# EAGLE schematic enigma (EAGLE 7.7.0)
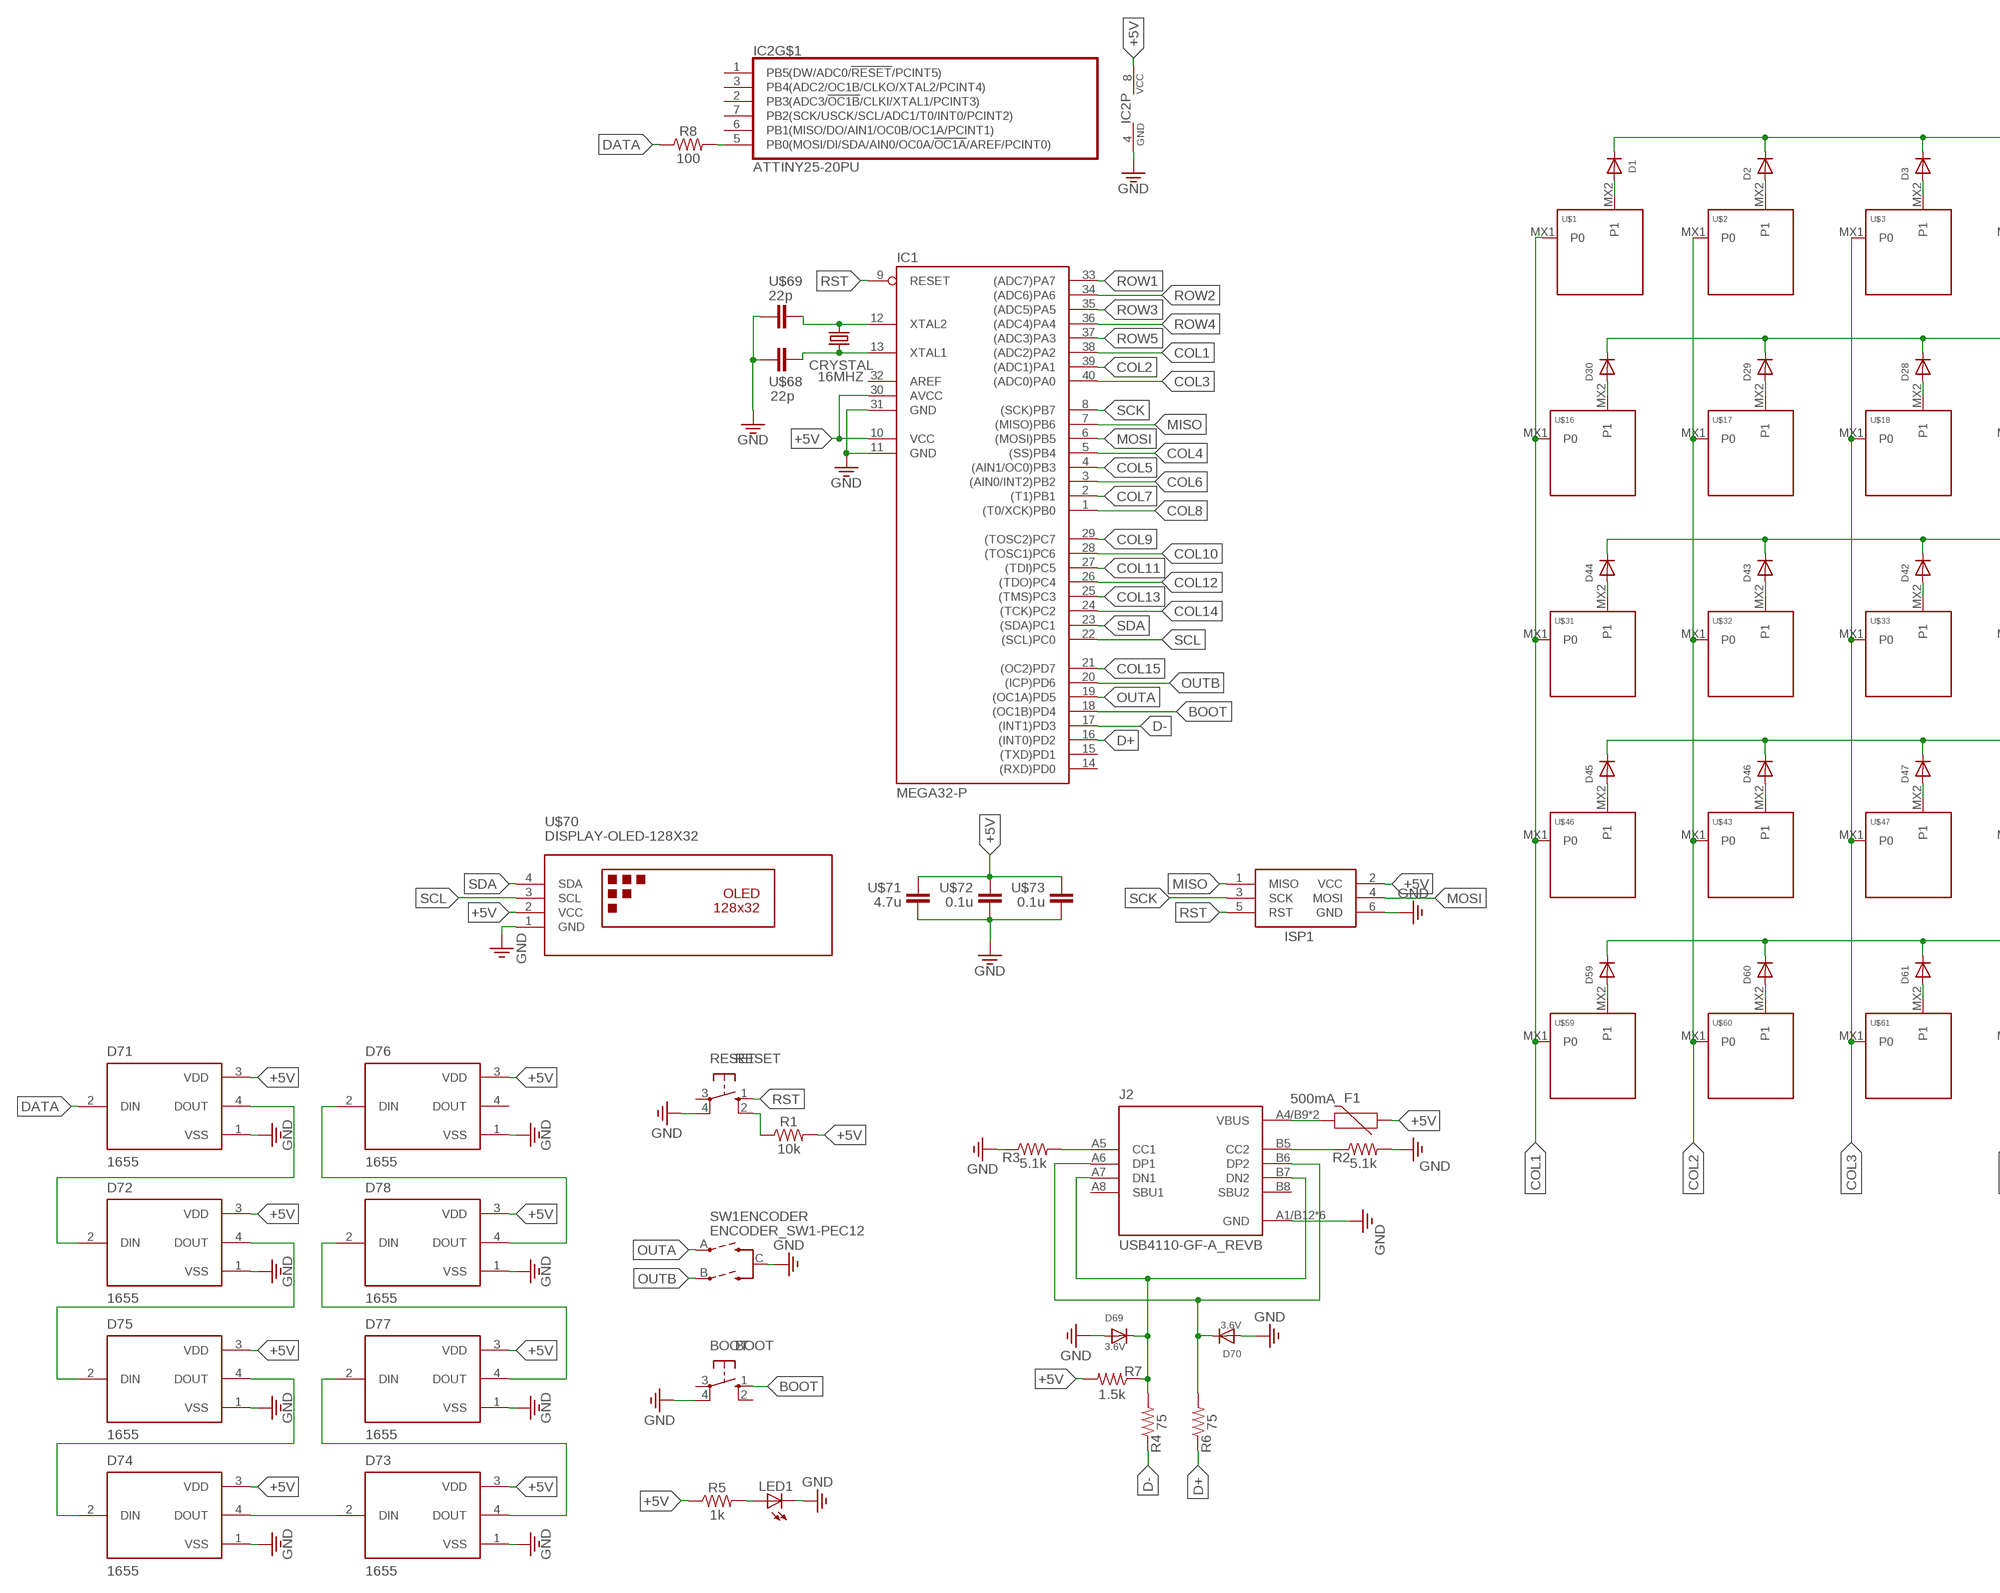
[diagram p0: schematic, sheet 1, part 1 of 2]
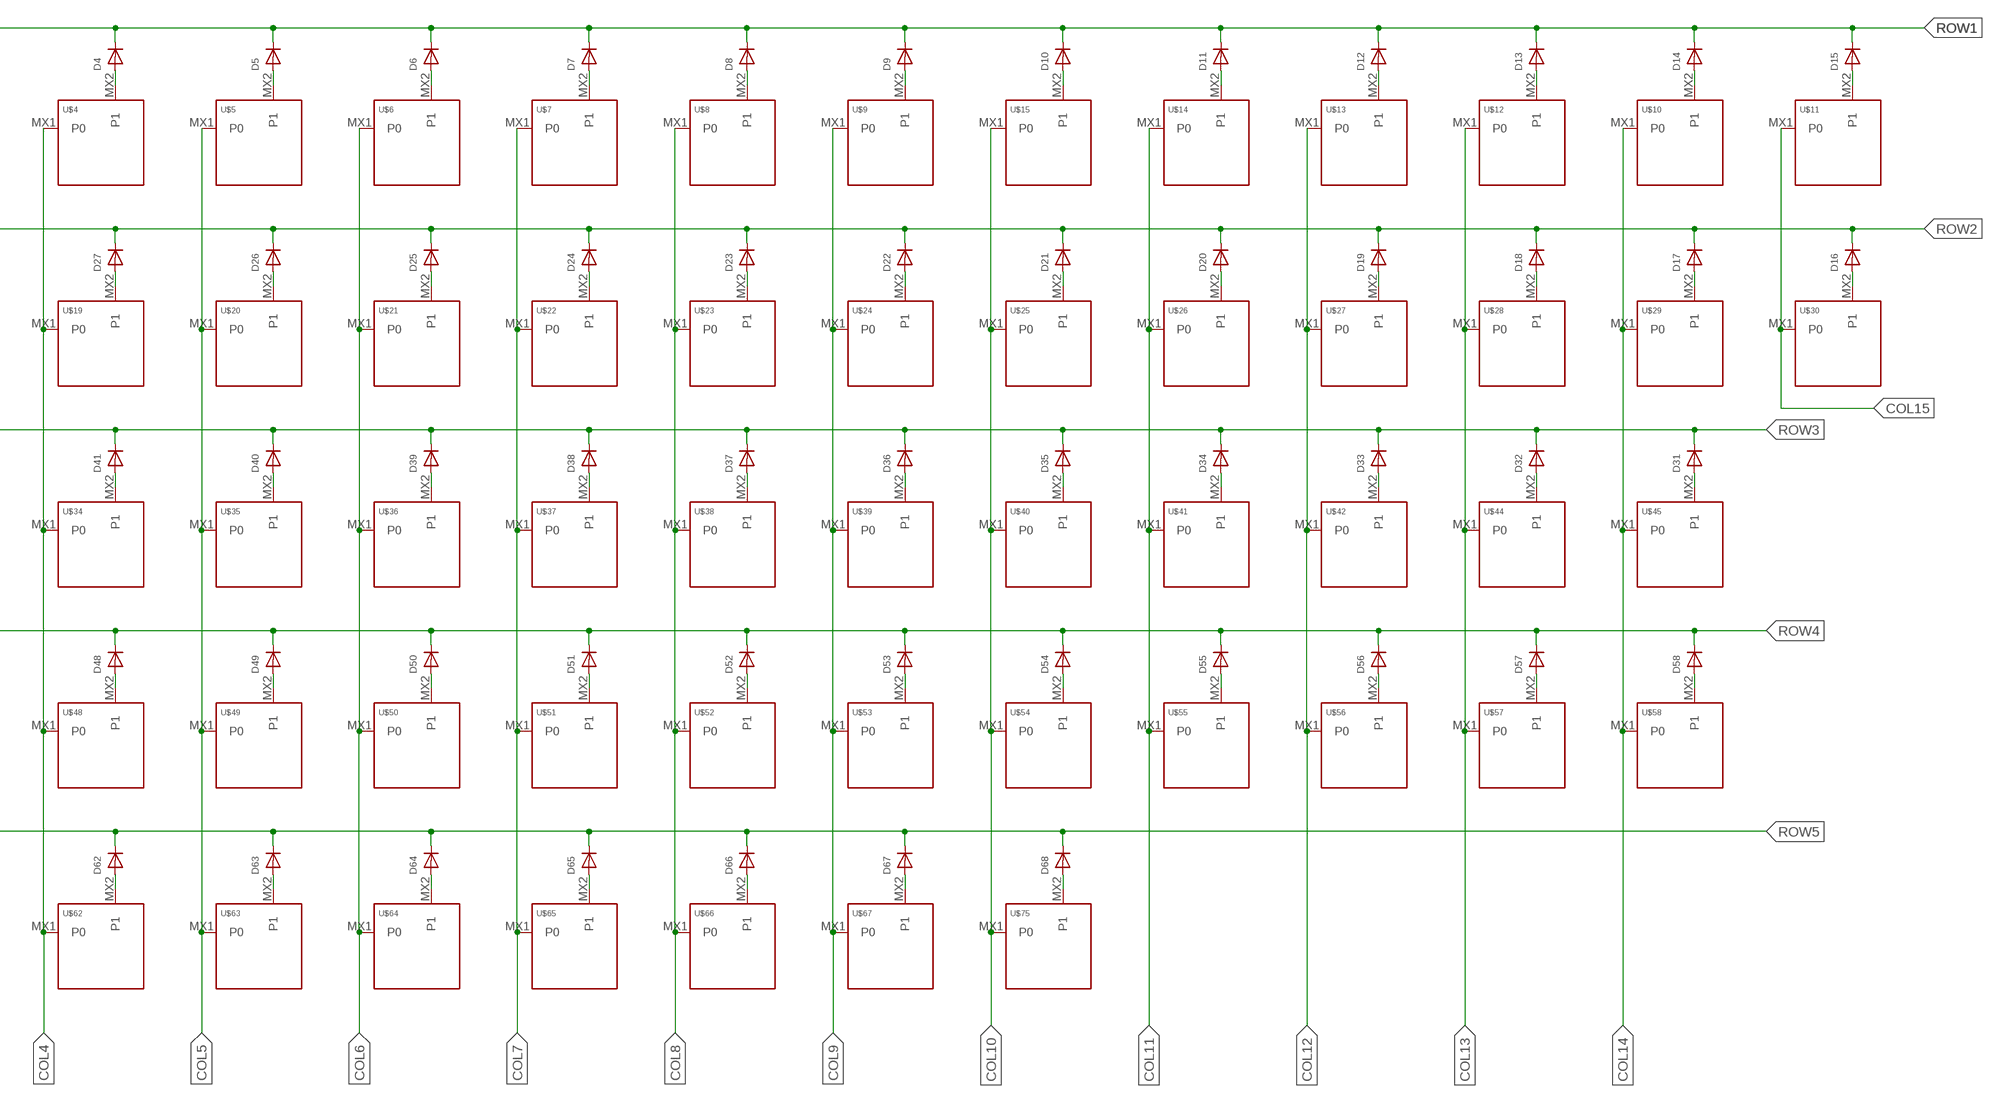
[diagram p1: schematic, sheet 1, part 2 of 2]

## Parts
BOOT  BOOT  10-XX  [B3F-10XX]
CRYSTAL  16MHZ  CRYSTALHC49U-V  [HC49U-V]
D1  DIODEDO-1N4148  [DO-1N4148]
D2  DIODEDO-1N4148  [DO-1N4148]
D3  DIODEDO-1N4148  [DO-1N4148]
D4  DIODEDO-1N4148  [DO-1N4148]
D5  DIODEDO-1N4148  [DO-1N4148]
D6  DIODEDO-1N4148  [DO-1N4148]
D7  DIODEDO-1N4148  [DO-1N4148]
D8  DIODEDO-1N4148  [DO-1N4148]
D9  DIODEDO-1N4148  [DO-1N4148]
D10  DIODEDO-1N4148  [DO-1N4148]
D11  DIODEDO-1N4148  [DO-1N4148]
D12  DIODEDO-1N4148  [DO-1N4148]
D13  DIODEDO-1N4148  [DO-1N4148]
D14  DIODEDO-1N4148  [DO-1N4148]
D15  DIODEDO-1N4148  [DO-1N4148]
D16  DIODEDO-1N4148  [DO-1N4148]
D17  DIODEDO-1N4148  [DO-1N4148]
D18  DIODEDO-1N4148  [DO-1N4148]
D19  DIODEDO-1N4148  [DO-1N4148]
D20  DIODEDO-1N4148  [DO-1N4148]
D21  DIODEDO-1N4148  [DO-1N4148]
D22  DIODEDO-1N4148  [DO-1N4148]
D23  DIODEDO-1N4148  [DO-1N4148]
D24  DIODEDO-1N4148  [DO-1N4148]
D25  DIODEDO-1N4148  [DO-1N4148]
D26  DIODEDO-1N4148  [DO-1N4148]
D27  DIODEDO-1N4148  [DO-1N4148]
D28  DIODEDO-1N4148  [DO-1N4148]
D29  DIODEDO-1N4148  [DO-1N4148]
D30  DIODEDO-1N4148  [DO-1N4148]
D31  DIODEDO-1N4148  [DO-1N4148]
D32  DIODEDO-1N4148  [DO-1N4148]
D33  DIODEDO-1N4148  [DO-1N4148]
D34  DIODEDO-1N4148  [DO-1N4148]
D35  DIODEDO-1N4148  [DO-1N4148]
D36  DIODEDO-1N4148  [DO-1N4148]
D37  DIODEDO-1N4148  [DO-1N4148]
D38  DIODEDO-1N4148  [DO-1N4148]
D39  DIODEDO-1N4148  [DO-1N4148]
D40  DIODEDO-1N4148  [DO-1N4148]
D41  DIODEDO-1N4148  [DO-1N4148]
D42  DIODEDO-1N4148  [DO-1N4148]
D43  DIODEDO-1N4148  [DO-1N4148]
D44  DIODEDO-1N4148  [DO-1N4148]
D45  DIODEDO-1N4148  [DO-1N4148]
D46  DIODEDO-1N4148  [DO-1N4148]
D47  DIODEDO-1N4148  [DO-1N4148]
D48  DIODEDO-1N4148  [DO-1N4148]
D49  DIODEDO-1N4148  [DO-1N4148]
D50  DIODEDO-1N4148  [DO-1N4148]
D51  DIODEDO-1N4148  [DO-1N4148]
D52  DIODEDO-1N4148  [DO-1N4148]
D53  DIODEDO-1N4148  [DO-1N4148]
D54  DIODEDO-1N4148  [DO-1N4148]
D55  DIODEDO-1N4148  [DO-1N4148]
D56  DIODEDO-1N4148  [DO-1N4148]
D57  DIODEDO-1N4148  [DO-1N4148]
D58  DIODEDO-1N4148  [DO-1N4148]
D59  DIODEDO-1N4148  [DO-1N4148]
D60  DIODEDO-1N4148  [DO-1N4148]
D61  DIODEDO-1N4148  [DO-1N4148]
D62  DIODEDO-1N4148  [DO-1N4148]
D63  DIODEDO-1N4148  [DO-1N4148]
D64  DIODEDO-1N4148  [DO-1N4148]
D65  DIODEDO-1N4148  [DO-1N4148]
D66  DIODEDO-1N4148  [DO-1N4148]
D67  DIODEDO-1N4148  [DO-1N4148]
D68  DIODEDO-1N4148  [DO-1N4148]
D69  3.6V  DIODEDO-1N4148  [DO-1N4148]
D70  3.6V  DIODEDO-1N4148  [DO-1N4148]
D71  1655  [LED_1655]
D72  1655  [LED_1655]
D73  1655  [LED_1655]
D74  1655  [LED_1655]
D75  1655  [LED_1655]
D76  1655  [LED_1655]
D77  1655  [LED_1655]
D78  1655  [LED_1655]
F1  500mA  PPTC_PTH  [PTH]
IC1  MEGA32-P  [DIL40]
IC2  ATTINY25-20PU  [DIL08]
ISP1  AVRISP-6  [AVRISP]
J2  USB4110-GF-A_REVB  [GCT_USB4110-GF-A_REVB]
LED1  LED5MM  [LED5MM]
R1  10k  RESISTORAXIAL-0.3  [AXIAL-0.3]
R2  5.1k  RESISTORAXIAL-0.3  [AXIAL-0.3]
R3  5.1k  RESISTORAXIAL-0.3  [AXIAL-0.3]
R4  75  RESISTORAXIAL-0.3  [AXIAL-0.3]
R5  1k  RESISTORAXIAL-0.3  [AXIAL-0.3]
R6  75  RESISTORAXIAL-0.3  [AXIAL-0.3]
R7  1.5k  RESISTORAXIAL-0.3  [AXIAL-0.3]
R8  100  RESISTORAXIAL-0.3  [AXIAL-0.3]
RESET  RESET  10-XX  [B3F-10XX]
SW1  ENCODER_SW1-PEC12  [PEC12_INCREMENTAL_ENCODER]
U$1  KEYSWITCH-PLAIN-MXHSPCB-1U  [MXHSPCB-1U]
U$2  KEYSWITCH-PLAIN-MXHSPCB-1U  [MXHSPCB-1U]
U$3  KEYSWITCH-PLAIN-MXHSPCB-1U  [MXHSPCB-1U]
U$4  KEYSWITCH-PLAIN-MXHSPCB-1U  [MXHSPCB-1U]
U$5  KEYSWITCH-PLAIN-MXHSPCB-1U  [MXHSPCB-1U]
U$6  KEYSWITCH-PLAIN-MXHSPCB-1U  [MXHSPCB-1U]
U$7  KEYSWITCH-PLAIN-MXHSPCB-1U  [MXHSPCB-1U]
U$8  KEYSWITCH-PLAIN-MXHSPCB-1U  [MXHSPCB-1U]
U$9  KEYSWITCH-PLAIN-MXHSPCB-1U  [MXHSPCB-1U]
U$10  KEYSWITCH-PLAIN-MXHSPCB-2U  [MXHSPCB-2U]
U$11  KEYSWITCH-PLAIN-MXHSPCB-1U  [MXHSPCB-1U]
U$12  KEYSWITCH-PLAIN-MXHSPCB-1U  [MXHSPCB-1U]
U$13  KEYSWITCH-PLAIN-MXHSPCB-1U  [MXHSPCB-1U]
U$14  KEYSWITCH-PLAIN-MXHSPCB-1U  [MXHSPCB-1U]
U$15  KEYSWITCH-PLAIN-MXHSPCB-1U  [MXHSPCB-1U]
U$16  KEYSWITCH-PLAIN-MXHSPCB-1U  [MXHSPCB-1U]
U$17  KEYSWITCH-PLAIN-MXHSPCB-1U  [MXHSPCB-1U]
U$18  KEYSWITCH-PLAIN-MXHSPCB-1U  [MXHSPCB-1U]
U$19  KEYSWITCH-PLAIN-MXHSPCB-1U  [MXHSPCB-1U]
U$20  KEYSWITCH-PLAIN-MXHSPCB-1U  [MXHSPCB-1U]
U$21  KEYSWITCH-PLAIN-MXHSPCB-1U  [MXHSPCB-1U]
U$22  KEYSWITCH-PLAIN-MXHSPCB-1U  [MXHSPCB-1U]
U$23  KEYSWITCH-PLAIN-MXHSPCB-1U  [MXHSPCB-1U]
U$24  KEYSWITCH-PLAIN-MXHSPCB-1U  [MXHSPCB-1U]
U$25  KEYSWITCH-PLAIN-MXHSPCB-1U  [MXHSPCB-1U]
U$26  KEYSWITCH-PLAIN-MXHSPCB-1U  [MXHSPCB-1U]
U$27  KEYSWITCH-PLAIN-MXHSPCB-1U  [MXHSPCB-1U]
U$28  KEYSWITCH-PLAIN-MXHSPCB-1U  [MXHSPCB-1U]
U$29  KEYSWITCH-PLAIN-MXHSPCB-1U  [MXHSPCB-1U]
U$30  KEYSWITCH-PLAIN-MXHSPCB-1U  [MXHSPCB-1U]
U$31  KEYSWITCH-PLAIN-MXHSPCB-1U  [MXHSPCB-1U]
U$32  KEYSWITCH-PLAIN-MXHSPCB-1U  [MXHSPCB-1U]
U$33  KEYSWITCH-PLAIN-MXHSPCB-1U  [MXHSPCB-1U]
U$34  KEYSWITCH-PLAIN-MXHSPCB-1U  [MXHSPCB-1U]
U$35  KEYSWITCH-PLAIN-MXHSPCB-1U  [MXHSPCB-1U]
U$36  KEYSWITCH-PLAIN-MXHSPCB-1U  [MXHSPCB-1U]
U$37  KEYSWITCH-PLAIN-MXHSPCB-1U  [MXHSPCB-1U]
U$38  KEYSWITCH-PLAIN-MXHSPCB-1U  [MXHSPCB-1U]
U$39  KEYSWITCH-PLAIN-MXHSPCB-1U  [MXHSPCB-1U]
U$40  KEYSWITCH-PLAIN-MXHSPCB-1U  [MXHSPCB-1U]
U$41  KEYSWITCH-PLAIN-MXHSPCB-1U  [MXHSPCB-1U]
U$42  KEYSWITCH-PLAIN-MXHSPCB-1U  [MXHSPCB-1U]
U$43  KEYSWITCH-PLAIN-MXHSPCB-1U  [MXHSPCB-1U]
U$44  KEYSWITCH-PLAIN-MXHSPCB-2U-FLIPPED  [MXHSPCB-2U-FLIPPED]
U$45  KEYSWITCH-PLAIN-MXHSPCB-1U  [MXHSPCB-1U]
U$46  KEYSWITCH-PLAIN-MXHSPCB-2U-FLIPPED  [MXHSPCB-2U-FLIPPED]
U$47  KEYSWITCH-PLAIN-MXHSPCB-1U  [MXHSPCB-1U]
U$48  KEYSWITCH-PLAIN-MXHSPCB-1U  [MXHSPCB-1U]
U$49  KEYSWITCH-PLAIN-MXHSPCB-1U  [MXHSPCB-1U]
U$50  KEYSWITCH-PLAIN-MXHSPCB-1U  [MXHSPCB-1U]
U$51  KEYSWITCH-PLAIN-MXHSPCB-1U  [MXHSPCB-1U]
U$52  KEYSWITCH-PLAIN-MXHSPCB-1U  [MXHSPCB-1U]
U$53  KEYSWITCH-PLAIN-MXHSPCB-1U  [MXHSPCB-1U]
U$54  KEYSWITCH-PLAIN-MXHSPCB-1U  [MXHSPCB-1U]
U$55  KEYSWITCH-PLAIN-MXHSPCB-1U  [MXHSPCB-1U]
U$56  KEYSWITCH-PLAIN-MXHSPCB-1U  [MXHSPCB-1U]
U$57  KEYSWITCH-PLAIN-MXHSPCB-1U  [MXHSPCB-1U]
U$58  KEYSWITCH-PLAIN-MXHSPCB-1U  [MXHSPCB-1U]
U$59  KEYSWITCH-PLAIN-MXHSPCB-1U  [MXHSPCB-1U]
U$60  KEYSWITCH-PLAIN-MXHSPCB-1U  [MXHSPCB-1U]
U$61  KEYSWITCH-PLAIN-MXHSPCB-1U  [MXHSPCB-1U]
U$62  KEYSWITCH-PLAIN-MXHSPCB-6.25U-FLIPPED  [MXHSPCB-6.25U-FLIPPED]
U$63  KEYSWITCH-PLAIN-MXHSPCB-1U  [MXHSPCB-1U]
U$64  KEYSWITCH-PLAIN-MXHSPCB-1U  [MXHSPCB-1U]
U$65  KEYSWITCH-PLAIN-MXHSPCB-1U  [MXHSPCB-1U]
U$66  KEYSWITCH-PLAIN-MXHSPCB-1U  [MXHSPCB-1U]
U$67  KEYSWITCH-PLAIN-MXHSPCB-1U  [MXHSPCB-1U]
U$68  22p  CAP  [CAP-TH]
U$69  22p  CAP  [CAP-TH]
U$70  DISPLAY-OLED-128X32  [DISPLAY-OLED-128X32]
U$71  4.7u  CAP  [CAP-TH]
U$72  0.1u  CAP  [CAP-TH]
U$73  0.1u  CAP  [CAP-TH]
U$75  KEYSWITCH-PLAIN-MXHSPCB-1U  [MXHSPCB-1U]

## Nets
3.3V: BOOT.4(P1) D69.A D70.A D71.1(VSS) D72.1(VSS) D73.1(VSS) D74.1(VSS) D75.1(VSS) D76.1(VSS) D77.1(VSS) D78.1(VSS) IC1.11(GND) IC1.31(GND) IC2.4(P:GND) ISP1.6(GND) J2.A1/B12(GND) J2.B1/A12(GND) J2.S1(GND) J2.S2(GND) J2.S3(GND) J2.S4(GND) LED1.K(C) R2.P$2 R3.P$1 RESET.4(P1) SW1.C(ENCODER:C) U$68.2 U$69.1 U$70.1(GND) U$71.1 U$72.1 U$73.1 ; supply symbol labelled GND
+5V: D71.3(VDD) D72.3(VDD) D73.3(VDD) D74.3(VDD) D75.3(VDD) D76.3(VDD) D77.3(VDD) D78.3(VDD) F1.P$1 IC1.10(VCC) IC1.30(AVCC) IC2.8(P:VCC) ISP1.2(VCC) R1.P$2 R5.P$1 R7.P$2 U$70.2(VCC) U$71.2 U$72.2 U$73.2
BOOT: BOOT.1(S) IC1.18((OC1B)PD4)
COL1: IC1.38((ADC2)PA2) U$1.MX1(P0) U$16.MX1(P0) U$31.MX1(P0) U$46.MX1(P0) U$59.MX1(P0)
COL2: IC1.39((ADC1)PA1) U$2.MX1(P0) U$17.MX1(P0) U$32.MX1(P0) U$43.MX1(P0) U$60.MX1(P0)
COL3: IC1.40((ADC0)PA0) U$3.MX1(P0) U$18.MX1(P0) U$33.MX1(P0) U$47.MX1(P0) U$61.MX1(P0)
COL4: IC1.5((SS)PB4) U$4.MX1(P0) U$19.MX1(P0) U$34.MX1(P0) U$48.MX1(P0) U$62.MX1(P0)
COL5: IC1.4((AIN1/OC0)PB3) U$5.MX1(P0) U$20.MX1(P0) U$35.MX1(P0) U$49.MX1(P0) U$63.MX1(P0)
COL6: IC1.3((AIN0/INT2)PB2) U$6.MX1(P0) U$21.MX1(P0) U$36.MX1(P0) U$50.MX1(P0) U$64.MX1(P0)
COL7: IC1.2((T1)PB1) U$7.MX1(P0) U$22.MX1(P0) U$37.MX1(P0) U$51.MX1(P0) U$65.MX1(P0)
COL8: IC1.1((T0/XCK)PB0) U$8.MX1(P0) U$23.MX1(P0) U$38.MX1(P0) U$52.MX1(P0) U$66.MX1(P0)
COL9: IC1.29((TOSC2)PC7) U$9.MX1(P0) U$24.MX1(P0) U$39.MX1(P0) U$53.MX1(P0) U$67.MX1(P0)
COL10: IC1.28((TOSC1)PC6) U$15.MX1(P0) U$25.MX1(P0) U$40.MX1(P0) U$54.MX1(P0) U$75.MX1(P0)
COL11: IC1.27((TDI)PC5) U$14.MX1(P0) U$26.MX1(P0) U$41.MX1(P0) U$55.MX1(P0)
COL12: IC1.26((TDO)PC4) U$13.MX1(P0) U$27.MX1(P0) U$42.MX1(P0) U$56.MX1(P0)
COL13: IC1.25((TMS)PC3) U$12.MX1(P0) U$28.MX1(P0) U$44.MX1(P0) U$57.MX1(P0)
COL14: IC1.24((TCK)PC2) U$10.MX1(P0) U$29.MX1(P0) U$45.MX1(P0) U$58.MX1(P0)
COL15: IC1.21((OC2)PD7) U$11.MX1(P0) U$30.MX1(P0)
D+: IC1.16((INT0)PD2) R6.P$1
D-: IC1.17((INT1)PD3) R4.P$1
DATA: D71.2(DIN) R8.P$1
MISO: IC1.7((MISO)PB6) ISP1.1(MISO)
MOSI: IC1.6((MOSI)PB5) ISP1.4(MOSI)
N$1: D1.A U$1.MX2(P1)
N$2: D2.A U$2.MX2(P1)
N$3: D3.A U$3.MX2(P1)
N$4: D4.A U$4.MX2(P1)
N$5: D5.A U$5.MX2(P1)
N$6: D6.A U$6.MX2(P1)
N$7: D7.A U$7.MX2(P1)
N$8: D8.A U$8.MX2(P1)
N$9: D9.A U$9.MX2(P1)
N$10: D10.A U$15.MX2(P1)
N$11: D11.A U$14.MX2(P1)
N$12: D12.A U$13.MX2(P1)
N$13: D13.A U$12.MX2(P1)
N$14: D14.A U$10.MX2(P1)
N$15: D15.A U$11.MX2(P1)
N$16: D30.A U$16.MX2(P1)
N$17: D29.A U$17.MX2(P1)
N$18: D28.A U$18.MX2(P1)
N$19: D27.A U$19.MX2(P1)
N$20: D26.A U$20.MX2(P1)
N$21: D25.A U$21.MX2(P1)
N$22: D24.A U$22.MX2(P1)
N$23: D23.A U$23.MX2(P1)
N$24: D22.A U$24.MX2(P1)
N$25: D21.A U$25.MX2(P1)
N$26: D20.A U$26.MX2(P1)
N$27: D19.A U$27.MX2(P1)
N$28: D18.A U$28.MX2(P1)
N$29: D17.A U$29.MX2(P1)
N$30: D16.A U$30.MX2(P1)
N$31: D44.A U$31.MX2(P1)
N$32: D43.A U$32.MX2(P1)
N$33: D42.A U$33.MX2(P1)
N$34: D41.A U$34.MX2(P1)
N$35: D40.A U$35.MX2(P1)
N$36: D39.A U$36.MX2(P1)
N$37: D38.A U$37.MX2(P1)
N$38: D37.A U$38.MX2(P1)
N$39: D36.A U$39.MX2(P1)
N$40: D35.A U$40.MX2(P1)
N$41: D34.A U$41.MX2(P1)
N$42: D33.A U$42.MX2(P1)
N$43: D32.A U$44.MX2(P1)
N$44: D31.A U$45.MX2(P1)
N$45: D45.A U$46.MX2(P1)
N$46: D46.A U$43.MX2(P1)
N$47: D47.A U$47.MX2(P1)
N$48: D48.A U$48.MX2(P1)
N$49: D49.A U$49.MX2(P1)
N$50: D50.A U$50.MX2(P1)
N$51: D51.A U$51.MX2(P1)
N$52: D52.A U$52.MX2(P1)
N$53: D53.A U$53.MX2(P1)
N$54: D54.A U$54.MX2(P1)
N$55: D55.A U$55.MX2(P1)
N$56: D56.A U$56.MX2(P1)
N$57: D57.A U$57.MX2(P1)
N$58: D58.A U$58.MX2(P1)
N$59: D67.A U$67.MX2(P1)
N$60: D66.A U$66.MX2(P1)
N$61: D65.A U$65.MX2(P1)
N$62: D64.A U$64.MX2(P1)
N$63: D63.A U$63.MX2(P1)
N$64: D62.A U$62.MX2(P1)
N$65: D61.A U$61.MX2(P1)
N$66: D60.A U$60.MX2(P1)
N$67: D68.A U$75.MX2(P1)
N$68: CRYSTAL.1 IC1.12(XTAL2) U$69.2
N$69: CRYSTAL.2 IC1.13(XTAL1) U$68.1
N$70: D59.A U$59.MX2(P1)
N$71: F1.P$2 J2.A4/B9(VBUS) J2.B4/A9(VBUS)
N$72: J2.B5(CC2) R2.P$1
N$73: J2.A5(CC1) R3.P$2
N$74: D69.C J2.A7(DN1) J2.B7(DN2) R4.P$2 R7.P$1
N$75: LED1.A R5.P$2
N$76: R1.P$1 RESET.2(S1)
N$77: IC2.5(PB0(MOSI/DI/SDA/AIN0/OC0A/!OC1A!/AREF/PCINT0)) R8.P$2
N$81: D71.4(DOUT) D72.2(DIN)
N$82: D70.C J2.A6(DP1) J2.B6(DP2) R6.P$2
N$83: D72.4(DOUT) D75.2(DIN)
N$84: D74.2(DIN) D75.4(DOUT)
N$85: D73.2(DIN) D74.4(DOUT)
N$86: D73.4(DOUT) D77.2(DIN)
N$88: D77.4(DOUT) D78.2(DIN)
N$89: D76.2(DIN) D78.4(DOUT)
OUTA: IC1.19((OC1A)PD5) SW1.A(ENCODER:A)
OUTB: IC1.20((ICP)PD6) SW1.B(ENCODER:B)
ROW1: D1.C D2.C D3.C D4.C D5.C D6.C D7.C D8.C D9.C D10.C D11.C D12.C D13.C D14.C D15.C IC1.33((ADC7)PA7)
ROW2: D16.C D17.C D18.C D19.C D20.C D21.C D22.C D23.C D24.C D25.C D26.C D27.C D28.C D29.C D30.C IC1.34((ADC6)PA6)
ROW3: D31.C D32.C D33.C D34.C D35.C D36.C D37.C D38.C D39.C D40.C D41.C D42.C D43.C D44.C IC1.35((ADC5)PA5)
ROW4: D45.C D46.C D47.C D48.C D49.C D50.C D51.C D52.C D53.C D54.C D55.C D56.C D57.C D58.C IC1.36((ADC4)PA4)
ROW5: D59.C D60.C D61.C D62.C D63.C D64.C D65.C D66.C D67.C D68.C IC1.37((ADC3)PA3)
RST: IC1.9(RESET) ISP1.5(RST) RESET.1(S)
SCK: IC1.8((SCK)PB7) ISP1.3(SCK)
SCL: IC1.22((SCL)PC0) U$70.3(SCL)
SDA: IC1.23((SDA)PC1) U$70.4(SDA)
Unconnected: BOOT.2(S1) BOOT.3(P) D76.4(DOUT) IC1.14((RXD)PD0) IC1.15((TXD)PD1) IC1.32(AREF) IC2.1(PB5(DW/ADC0/!RESET!/PCINT5)) IC2.2(PB3(ADC3/!OC1B!/CLKI/XTAL1/PCINT3)) IC2.3(PB4(ADC2/OC1B/CLKO/XTAL2/PCINT4)) IC2.6(PB1(MISO/DO/AIN1/OC0B/OC1A/PCINT1)) IC2.7(PB2(SCK/USCK/SCL/ADC1/T0/INT0/PCINT2)) J2.A8(SBU1) J2.B8(SBU2) RESET.3(P) SW1.P1 SW1.P2

## Library data of the parts
BOOT RESET = switch-omron:10-XX: OMRON SWITCH; MPN: B3F-1000; OC_FARNELL: 176432; OC_NEWARK: 36M3542
CRYSTAL = adafruit:CRYSTAL: CRYSTAL; OC_FARNELL: 1666969; OC_NEWARK: unknown
D1-D70 = adafruit:DIODE: Diode SMADIODE - SMA Surface Mount Package 20V 1A Schottky Diode Digikey: 641-1014-6-ND DO-1N4148 - Through Hole Small Current Diode SOD-123 20V 1 A (.5mV Vf) Schottky Diode - Digikey: MBRX120TPMSCT-ND SOD-323 10V 570mA (.38mV Vf, 3ns) Schottky Diode - Digikey: ZLLS410CT-ND SOD-523 30V 30mA Schottky Diode (RB751S-40TE61) - Digikey: RB751S-40TE61CT-ND SOT23-R/W - SOT23 Package (R = Solder Paste/Reflow Ovens, W = Hand-Soldering) BAT54Film 40V 300mA - Digikey: 497-7162-1-ND
D71-D78 = 1655:1655: Ws2812b 5050 Rgb Led With Integrated Driver Chip Pack Of 10; DESCRIPTION: Addressable Lighting Neopixel 10 LED Discrete Serial (Shift Register) Red, Green, Blue (RGB) 5.00mm L x 5.00mm W; MF: Adafruit; MP: 1655; PACKAGE: TO-3 Adafruit
F1 = SparkFun-Fuses:PPTC: Resettable Fuse PPTC Resettable Fuse. Really a sort of resistor with a polymeric positive temperature coefficient whose resistance increases dramatically with an increase in temperature. When heated by the power passing through the resistance rises causing the current to be limited, protecting the circuit. This is achieved by the transition of the polymer from a crystalline to an amorphous state where the conductive carbon separates breaking the conductive pathways found in the cool crystalline structure. When a PPTC cools back down it resumes conducting letting the circuit turn back on. SparkFun Products: SparkFun RedBoard - Programmed with Arduino <https://www.sparkfun.com/products/12757> Pro Micro - 5V/16MHz <https://www.sparkfun.com/products/12640> Arduino Pro 328 - 5V/16MHz <https://www.sparkfun.com/products/10915> MP3 Trigger <https://www.sparkfun.com/products/13720>; PROD_ID: RES-08490; VALUE: 72V/0.25A
IC1 = atmel:MEGA32-P: MICROCONTROLLER 32 Kbytes FLASH 2 Kbytes SRAM 1 Kbytes EEPROM USART 8-channel 10 bit ADC Source: www.atmel.com .. doc2503.pdf; MPN: ATMEGA32-16PU; OC_FARNELL: 1661729; OC_NEWARK: 51P1794
IC2 = atmel@1:ATTINY*5: 8-bit AVR tiny Microcontroller Status aktiv aktiv aktiv ATtiny25(V) ATtiny45(V) ATtiny85(V) General purpose working registers 32 SRAM 128 B 256 B 512 B Program flash memory 2 kB 4 kB 8 kB EEPROM 128 B 256 B 512 B 8-bit Timer/Counter 1 8-bit Timer/Counter (high speed) 1 USI 1 ADC channels 4 ADC resolution 10 bit AC 1 Watchdog 1 General purpose I/O 6 External interrupts 6 Operating voltage 1.8 ... 5.5 V for ATtiny#5V 2.7 ... 5.5 V for ATtiny#5 Speed grade 0 ... 4 MHz @ 1.8 ... 5.5 V for ATtiny#5V 0 ... 10 MHz @ 2.7 ... 5.5 V for ATtiny#5V 0 ... 10 MHz @ 2.7 ... 5.5 V for ATtiny#5 0 ... 20 MHz @ 4.5 ... 5.5V for ATtiny#5 Clock options calibrated internal 8/6.4 MHz oscillator external crystal oscillator / ceramic resonator external 32.768 kHz low-frequency crystal oscillator internal 128 kHz oscillator high frequency PLL clock external clock input
ISP1 = adafruit:AVRISP: AVR ISP HEADER Standard 6 pin header for AVR programming
J2 = USB4110-GF-A_REVB:USB4110-GF-A_REVB; DESCRIPTION: USB-C (USB TYPE-C) USB 2.0 Receptacle Connector 24 (16+8 Dummy) Position Surface Mount, Right Angle; Through Hole; MF: GCT; MP: USB4110-GF-A; PACKAGE: None; PURCHASE-URL: https://pricing.snapeda.com/search/part/USB4110-GF-A/?ref=eda
LED1 = adafruit:LED: LED OSRAM: - CHIPLED LG R971, LG N971, LY N971, LG Q971, LY Q971, LO R971, LY R971 LH N974, LH R974 LS Q976, LO Q976, LY Q976 LO Q996 - Hyper CHIPLED LW Q18S LB Q993, LB Q99A, LB R99A - SideLED LS A670, LO A670, LY A670, LG A670, LP A670 LB A673, LV A673, LT A673, LW A673 LH A674 LY A675 LS A676, LA A676, LO A676, LY A676, LW A676 LS A679, LY A679, LG A679 - Hyper Micro SIDELED® LS Y876, LA Y876, LO Y876, LY Y876 LT Y87S - SmartLED LW L88C, LW L88S LB L89C, LB L89S, LG L890 LS L89K, LO L89K, LY L89K LS L896, LA L896, LO L896, LY L896 - TOPLED LS T670, LO T670, LY T670, LG T670, LP T670 LSG T670, LSP T670, LSY T670, LOP T670, LYG T670 LG T671, LOG T671, LSG T671 LB T673, LV T673, LT T673, LW T673 LH T674 LS T676, LA T676, LO T676, LY T676, LB T676, LH T676, LSB T676, LW T676 LB T67C, LV T67C, LT T67C, LS T67K, LO T67K, LY T67K, LW E67C LS E67B, LA E67B, LO E67B, LY E67B, LB E67C, LV E67C, LT E67C LW T67C LS T679, LY T679, LG T679 LS T770, LO T770, LY T770, LG T770, LP T770 LB T773, LV T773, LT T773, LW T773 LH T774 LS E675, LA E675, LY E675, LS T675 LS T776, LA T776, LO T776, LY T776, LB T776 LHGB T686 LT T68C, LB T68C - Hyper Mini TOPLED® LB M676 - Mini TOPLED Santana® LG M470 LS M47K, LO M47K, LY M47K Source: http://www.osram.convergy.de/
R1-R8 = SparkFun-Resistors:RESISTOR: Generic Resistor Package
SW1 = dp_devices.v6:ENCODER_SW1: Incremental Encoder with push switch
U$1-U$67 U$75 = Keyboard:KEYSWITCH-PLAIN
U$68 U$69 U$71-U$73 = ECE5_WS:CAP: This is a through hole capacitor for ECE5 worksheet
U$70 = diy-modules (1):DISPLAY-OLED-128X32: 128x32 Dot Matrix OLED Module with I2C interface based on SSD1306 chip More details available here: http://www.tinyosshop.com/index.php?route=product/product&product_id=953 Schematic available here: http://www.tinyosshop.com/datasheet/OLED%2012832.pdf SSD1306 datasheet: https://cdn-shop.adafruit.com/datasheets/SSD1306.pdf Click here to find device on ebay.com <http://www.ebay.com/sch/oled+display+128x32+i2c>